# Altium schematic sheet Microcontroller.SchDoc: Microcontroller
size B; DrawnBy: Jasper Yun; SheetNumber: 4; SheetTotal: 11; Competition: SAC 2021; Subteam: Avionics; University: McGill University; Location: Montreal, Quebec; Project: Avionics Project Name; MRT: McGill Rocket Team
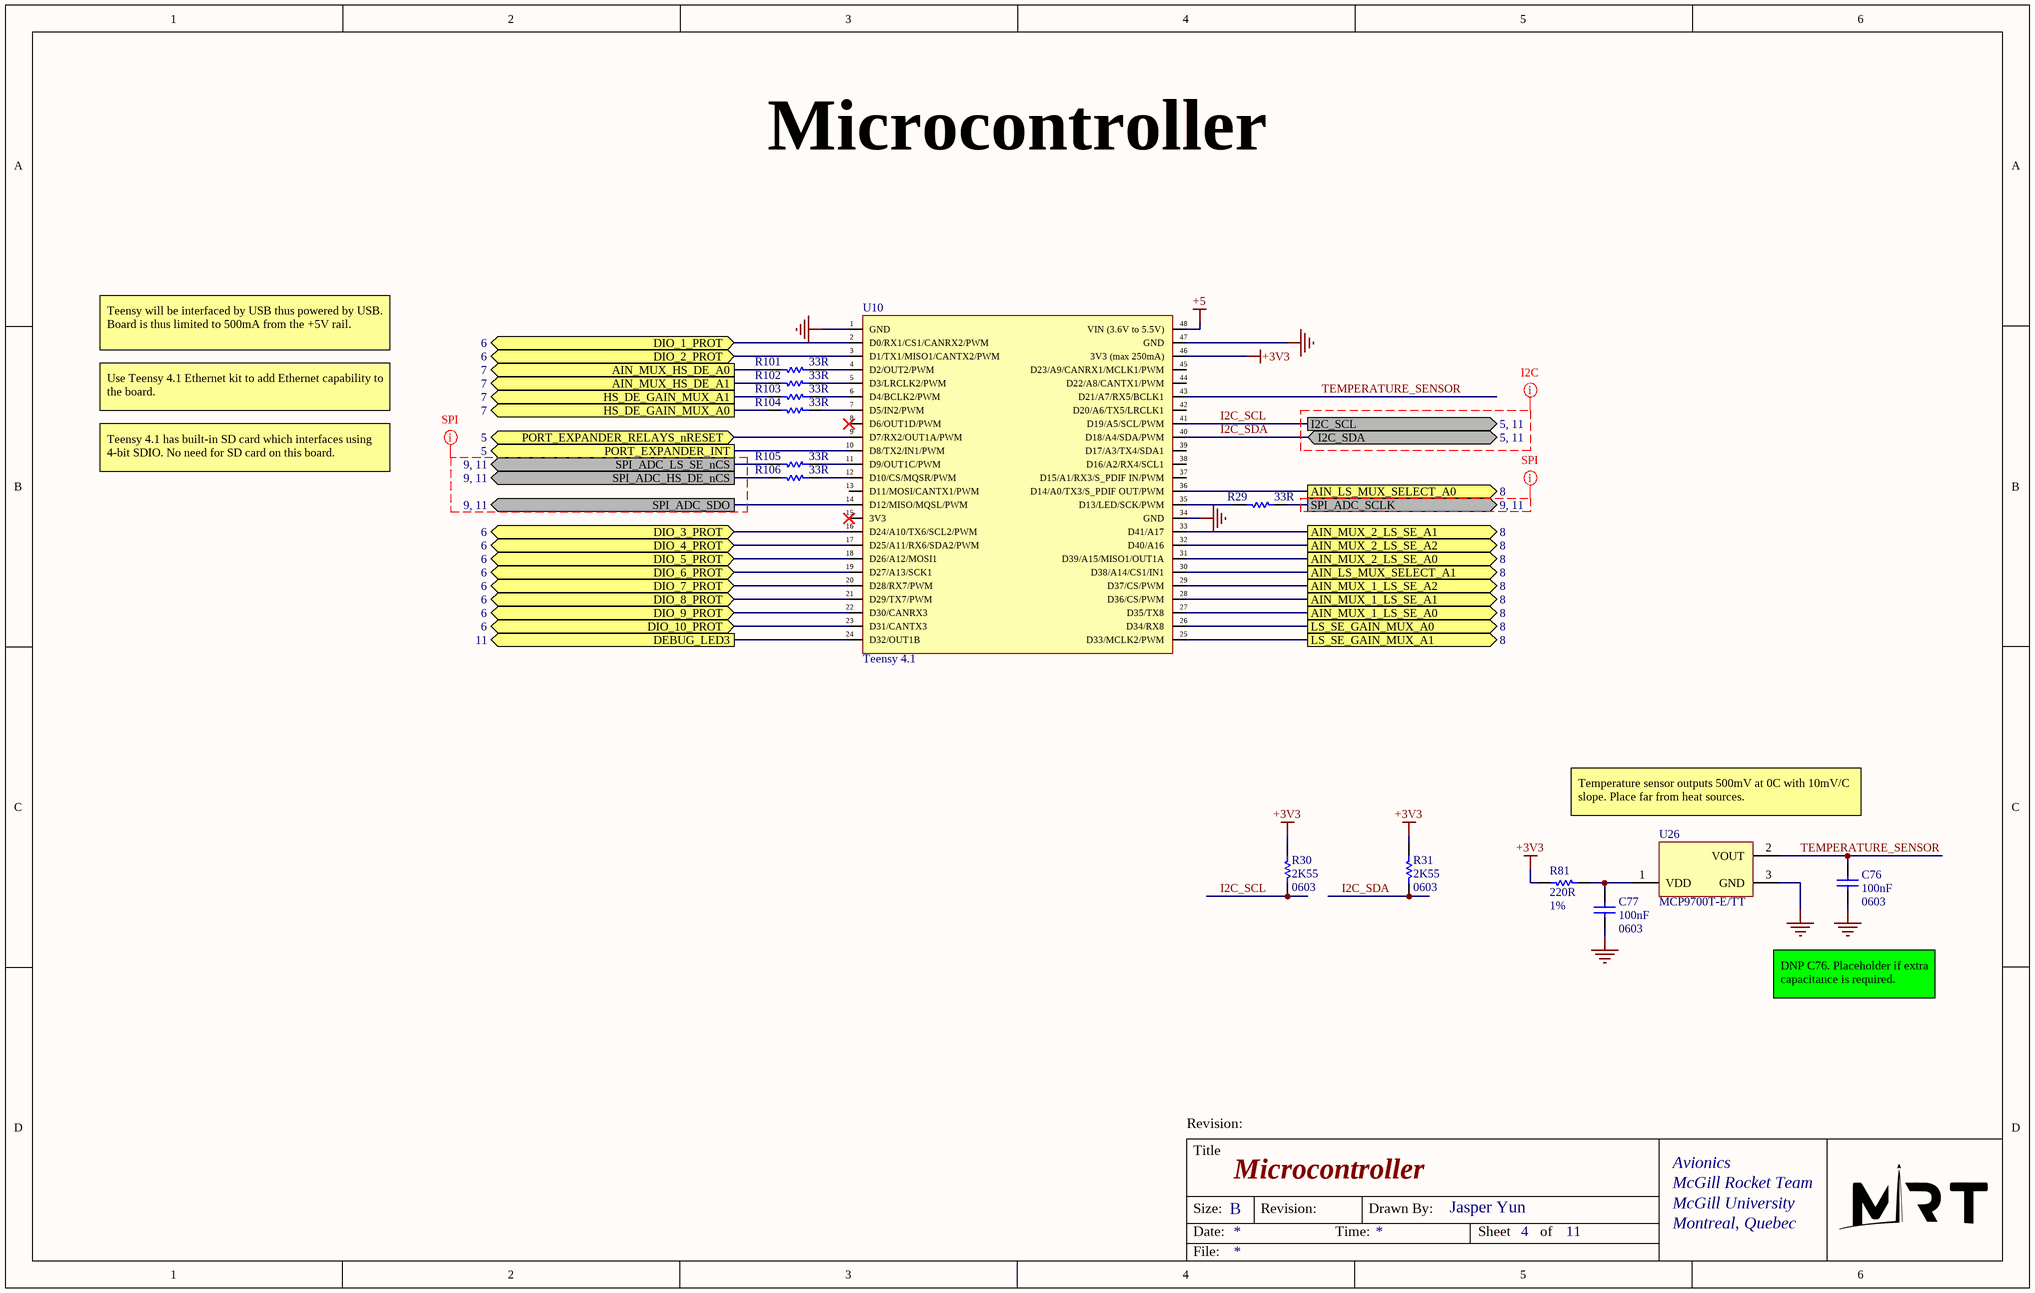
[diagram p0: Microcontroller.SchDoc]

## Parts
C76  100nF  value 0603  [0603 CAP SAMSUNG CL10C]
C77  100nF  value 0603  [0603 CAP SAMSUNG CL10C]
R29  33R  [0603 RES]
R30  2K55  value 0603  [0603 RES]
R31  2K55  value 0603  [0603 RES]
R81  220R  value 1%  [0603 RES]
R101  33R  [0603 RES]
R102  33R  [0603 RES]
R103  33R  [0603 RES]
R104  33R  [0603 RES]
R105  33R  [0603 RES]
R106  33R  [0603 RES]
U10  Teensy 4.1  [Teensy 4.1]
U26  MCP9700T-E/TT  [SOT-23-TT3_M]

## Ports
AIN_LS_MUX_SELECT_A0 (out, see 8), AIN_LS_MUX_SELECT_A1 (out, see 8), AIN_MUX_1_LS_SE_A0 (out, see 8), AIN_MUX_1_LS_SE_A1 (out, see 8), AIN_MUX_1_LS_SE_A2 (out, see 8), AIN_MUX_2_LS_SE_A0 (out, see 8), AIN_MUX_2_LS_SE_A1 (out, see 8), AIN_MUX_2_LS_SE_A2 (out, see 8), AIN_MUX_HS_DE_A0 (out, see 7), AIN_MUX_HS_DE_A1 (out, see 7), DEBUG_LED3 (out, see 11), DIO_1_PROT (bidir, see 6), DIO_2_PROT (bidir, see 6), DIO_3_PROT (bidir, see 6), DIO_4_PROT (bidir, see 6), DIO_5_PROT (bidir, see 6), DIO_6_PROT (bidir, see 6), DIO_7_PROT (bidir, see 6), DIO_8_PROT (bidir, see 6), DIO_9_PROT (bidir, see 6), DIO_10_PROT (bidir, see 6), HS_DE_GAIN_MUX_A0 (out, see 7), HS_DE_GAIN_MUX_A1 (out, see 7), I2C_SCL (out, see 5, 11), I2C_SDA (bidir, see 5, 11), LS_SE_GAIN_MUX_A0 (out, see 8), LS_SE_GAIN_MUX_A1 (out, see 8), PORT_EXPANDER_INT (out, see 5), PORT_EXPANDER_RELAYS_nRESET (bidir, see 5), SPI_ADC_HS_DE_nCS (out, see 9, 11), SPI_ADC_LS_SE_nCS (out, see 9, 11), SPI_ADC_SCLK (out, see 9, 11), SPI_ADC_SDO (out, see 9, 11)

## Nets
+3V3: R30.1 R31.1 R81.1 U10.46(3V3_(max_250mA))
+5: U10.48(VIN_(3.6V_to_5.5V))
GND: C76.1 C77.1 U10.1(GND) U10.34(GND) U10.47(GND) U26.3(GND)
AIN_LS_MUX_SELECT_A0: U10.36(D14/A0/TX3/S_PDIF_OUT/PWM) ; port AIN_LS_MUX_SELECT_A0
AIN_LS_MUX_SELECT_A1: U10.30(D38/A14/CS1/IN1) ; port AIN_LS_MUX_SELECT_A1
AIN_MUX_1_LS_SE_A0: U10.27(D35/TX8) ; port AIN_MUX_1_LS_SE_A0
AIN_MUX_1_LS_SE_A1: U10.28(D36/CS/PWM) ; port AIN_MUX_1_LS_SE_A1
AIN_MUX_1_LS_SE_A2: U10.29(D37/CS/PWM) ; port AIN_MUX_1_LS_SE_A2
AIN_MUX_2_LS_SE_A0: U10.31(D39/A15/MISO1/OUT1A) ; port AIN_MUX_2_LS_SE_A0
AIN_MUX_2_LS_SE_A1: U10.33(D41/A17) ; port AIN_MUX_2_LS_SE_A1
AIN_MUX_2_LS_SE_A2: U10.32(D40/A16) ; port AIN_MUX_2_LS_SE_A2
AIN_MUX_HS_DE_A0: R101.1 ; port AIN_MUX_HS_DE_A0
AIN_MUX_HS_DE_A1: R102.1 ; port AIN_MUX_HS_DE_A1
DEBUG_LED3: U10.24(D32/OUT1B) ; port DEBUG_LED3
DIO_1_PROT: U10.2(D0/RX1/CS1/CANRX2/PWM) ; port DIO_1_PROT
DIO_2_PROT: U10.3(D1/TX1/MISO1/CANTX2/PWM) ; port DIO_2_PROT
DIO_3_PROT: U10.16(D24/A10/TX6/SCL2/PWM) ; port DIO_3_PROT
DIO_4_PROT: U10.17(D25/A11/RX6/SDA2/PWM) ; port DIO_4_PROT
DIO_5_PROT: U10.18(D26/A12/MOSI1) ; port DIO_5_PROT
DIO_6_PROT: U10.19(D27/A13/SCK1) ; port DIO_6_PROT
DIO_7_PROT: U10.20(D28/RX7/PWM) ; port DIO_7_PROT
DIO_8_PROT: U10.21(D29/TX7/PWM) ; port DIO_8_PROT
DIO_9_PROT: U10.22(D30/CANRX3) ; port DIO_9_PROT
DIO_10_PROT: U10.23(D31/CANTX3) ; port DIO_10_PROT
HS_DE_GAIN_MUX_A0: R104.1 ; port HS_DE_GAIN_MUX_A0
HS_DE_GAIN_MUX_A1: R103.1 ; port HS_DE_GAIN_MUX_A1
I2C_SCL: R30.2 U10.41(D19/A5/SCL/PWM) ; port I2C_SCL
I2C_SDA: R31.2 U10.40(D18/A4/SDA/PWM) ; port I2C_SDA
LS_SE_GAIN_MUX_A0: U10.26(D34/RX8) ; port LS_SE_GAIN_MUX_A0
LS_SE_GAIN_MUX_A1: U10.25(D33/MCLK2/PWM) ; port LS_SE_GAIN_MUX_A1
PORT_EXPANDER_INT: U10.10(D8/TX2/IN1/PWM) ; port PORT_EXPANDER_INT
PORT_EXPANDER_RELAYS_nRESET: U10.9(D7/RX2/OUT1A/PWM) ; port PORT_EXPANDER_RELAYS_nRESET
SPI_ADC_HS_DE_nCS: R106.1 ; port SPI_ADC_HS_DE_nCS
SPI_ADC_LS_SE_nCS: R105.1 ; port SPI_ADC_LS_SE_nCS
SPI_ADC_SCLK: R29.2 ; port SPI_ADC_SCLK
SPI_ADC_SDO: U10.14(D12/MISO/MQSL/PWM) ; port SPI_ADC_SDO
TEMPERATURE_SENSOR: C76.2 U10.43(D21/A7/RX5/BCLK1) U26.2(VOUT)
NetC77_2: C77.2 R81.2 U26.1(VDD)
NetR29_1: R29.1 U10.35(D13/LED/SCK/PWM)
NetR101_2: R101.2 U10.4(D2/OUT2/PWM)
NetR102_2: R102.2 U10.5(D3/LRCLK2/PWM)
NetR103_2: R103.2 U10.6(D4/BCLK2/PWM)
NetR104_2: R104.2 U10.7(D5/IN2/PWM)
NetR105_2: R105.2 U10.11(D9/OUT1C/PWM)
NetR106_2: R106.2 U10.12(D10/CS/MQSR/PWM)

Not connected (* = marked no-connect by the designer): U10 8(D6/OUT1D/PWM)* 13(D11/MOSI/CANTX1/PWM) 15(3V3)* 37(D15/A1/RX3/S_PDIF_IN/PWM) 38(D16/A2/RX4/SCL1) 39(D17/A3/TX4/SDA1) 42(D20/A6/TX5/LRCLK1) 44(D22/A8/CANTX1/PWM) 45(D23/A9/CANRX1/MCLK1/PWM)

## Layout directives
net class I2C: (no net found under the mark)
net class SPI: (no net found under the mark)

## Notes on the sheet
- Teensy will be interfaced by USB thus powered by USB. Board is thus limited to 500mA from the +5V rail.
- Use Teensy 4.1 Ethernet kit to add Ethernet capability to the board.
- Teensy 4.1 has built-in SD card which interfaces using 4-bit SDIO. No need for SD card on this board.
- Temperature sensor outputs 500mV at 0C with 10mV/C slope. Place far from heat sources.
- DNP C76. Placeholder if extra capacitance is required.
- Title
- Size:
- Date:
- B
- Revision:
- Time:
- Drawn By:
- Sheet
- of
- File:

## Library data of the parts
C76 C77 = Cap: Capacitor; Published: 8-Jun-2000; LatestRevisionDate: 17-Jul-2002; LatestRevisionNote: Re-released for DXP Platform.; PackageReference: RAD-0.3; Publisher: Altium Limited; PackageDescription: Radial Cap, Thru-Hole; 2 Leads; 0.3 in Pin Spacing
R29 R101-R106 = Res1: Resistor; Value: 1%; Published: 8-Jun-2000; LatestRevisionDate: 17-Jul-2002; LatestRevisionNote: Re-released for DXP Platform.; PackageReference: AXIAL-0.3; Publisher: Altium Limited; PackageDescription: Axial Device, Thru-Hole; 2 Leads; 0.3 in Pin Spacing
R30 R31 R81 = Res1: Resistor; Published: 8-Jun-2000; LatestRevisionDate: 17-Jul-2002; LatestRevisionNote: Re-released for DXP Platform.; PackageReference: AXIAL-0.3; Publisher: Altium Limited; PackageDescription: Axial Device, Thru-Hole; 2 Leads; 0.3 in Pin Spacing
U10 = Teensy 4.1: Teensy 4.1 breakout (no ethernet or USB host pins exposed)
U26 = CMP-0192-00220-1: Low-Power Linear Active Thermistor IC, 3-Pin SOT-23, Extended Temperature, Tape and Reel; DatasheetVersion: revE, Apr-2009; PackageVersion: revBB, Aug-2009; PackageReference: SOT-23-TT3; Code_IPC: SOT23-3; PackageDescription: 3-Lead Plastic Small Outline Transistor (TT) [SOT-23]